# Altium schematic sheet 2.54-1_19P母1_2.54-1_19P母.schdoc
size 124 x 101 mm
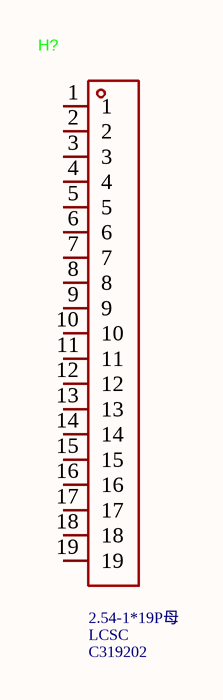
[diagram p0: 2.54-1_19P母1_2.54-1_19P母.schdoc]

## Parts
H?  Supplier: LCSC  Supplier Part: C319202  [HDR-TH_19P-P2.54-V-F]  (hidden comment: 2.54-1*19P母)

## Nets

Not connected (* = marked no-connect by the designer): H? 1 2 3 4 5 6 7 8 9 10 11 12 13 14 15 16 17 18 19

## Library data of the parts
H? = 2.54-1*19P母: Manufacturer: BOOMELE(博穆精密); Add into BOM: yes; Pitch: 2.54mm; Circular Hole / Square Hole: Square Hole; Number of Positions: 19P; Holes Direction: Top; Symbol: 2.54-1*19P母; Device: 2.54-1*19P母; Manufacturer Part: 2.54-1*19P母; LCSC Part Name: 间距:2.54mm 直插; Supplier Footprint: 插件,P=2.54mm; JLCPCB Part Class: Extended Part; Convert to PCB: yes; Row Spacing: -; Mounting Type: Through Hole; Number of Rows: 1; Insulation Height: -; Contact Material: -; Contact Plating: -